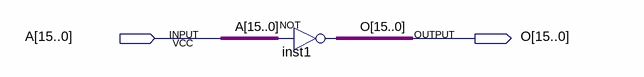
[diagram p0: schematic sheet]
// Quartus schematic atonota.bdf as structural Verilog: 1 symbols, 2 pins
module atonota (
  input  [15:0] A,
  output [15:0] O
);

  assign O = ~A;  // NOT inst1, 16 bits wide
endmodule
